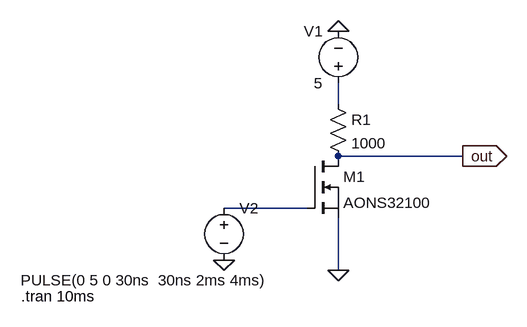
[diagram p0: schematic NOT_v1.asc]
NOT_v1.asc, the LTspice schematic file:
Version 4
SHEET 1 880 680
WIRE 160 144 160 112
WIRE 352 224 160 224
WIRE 112 304 -16 304
WIRE 160 400 160 320
FLAG 352 224 out
IOPIN 352 224 Out
FLAG 160 32 0
FLAG -16 384 0
FLAG 160 400 0
SYMBOL voltage 160 128 R180
WINDOW 0 24 96 Left 2
WINDOW 3 24 16 Left 2
WINDOW 123 0 0 Left 0
WINDOW 39 0 0 Left 0
SYMATTR InstName V1
SYMATTR Value 5
SYMBOL res 144 128 R0
SYMATTR InstName R1
SYMATTR Value 1000
SYMBOL nmos 112 224 R0
SYMATTR InstName M1
SYMATTR Value AONS32100
SYMBOL voltage -16 288 R0
WINDOW 3 -313 127 Left 2
WINDOW 123 0 0 Left 0
WINDOW 39 0 0 Left 0
SYMATTR Value PULSE(0 5 0 30ns  30ns 2ms 4ms)
SYMATTR InstName V2
TEXT -328 440 Left 2 !.tran 10ms

The netlist it stands for:
* NOT_v1.asc
V1 N001 0 5
R1 N001 out 1000
M1 out N002 0 0 AONS32100
V2 N002 0 PULSE(0 5 0 30ns  30ns 2ms 4ms)
.model NMOS NMOS
.model PMOS PMOS
.lib standard.mos
.tran 10ms
.backanno
.end